# EAGLE schematic M220X (EAGLE 6.6.0)
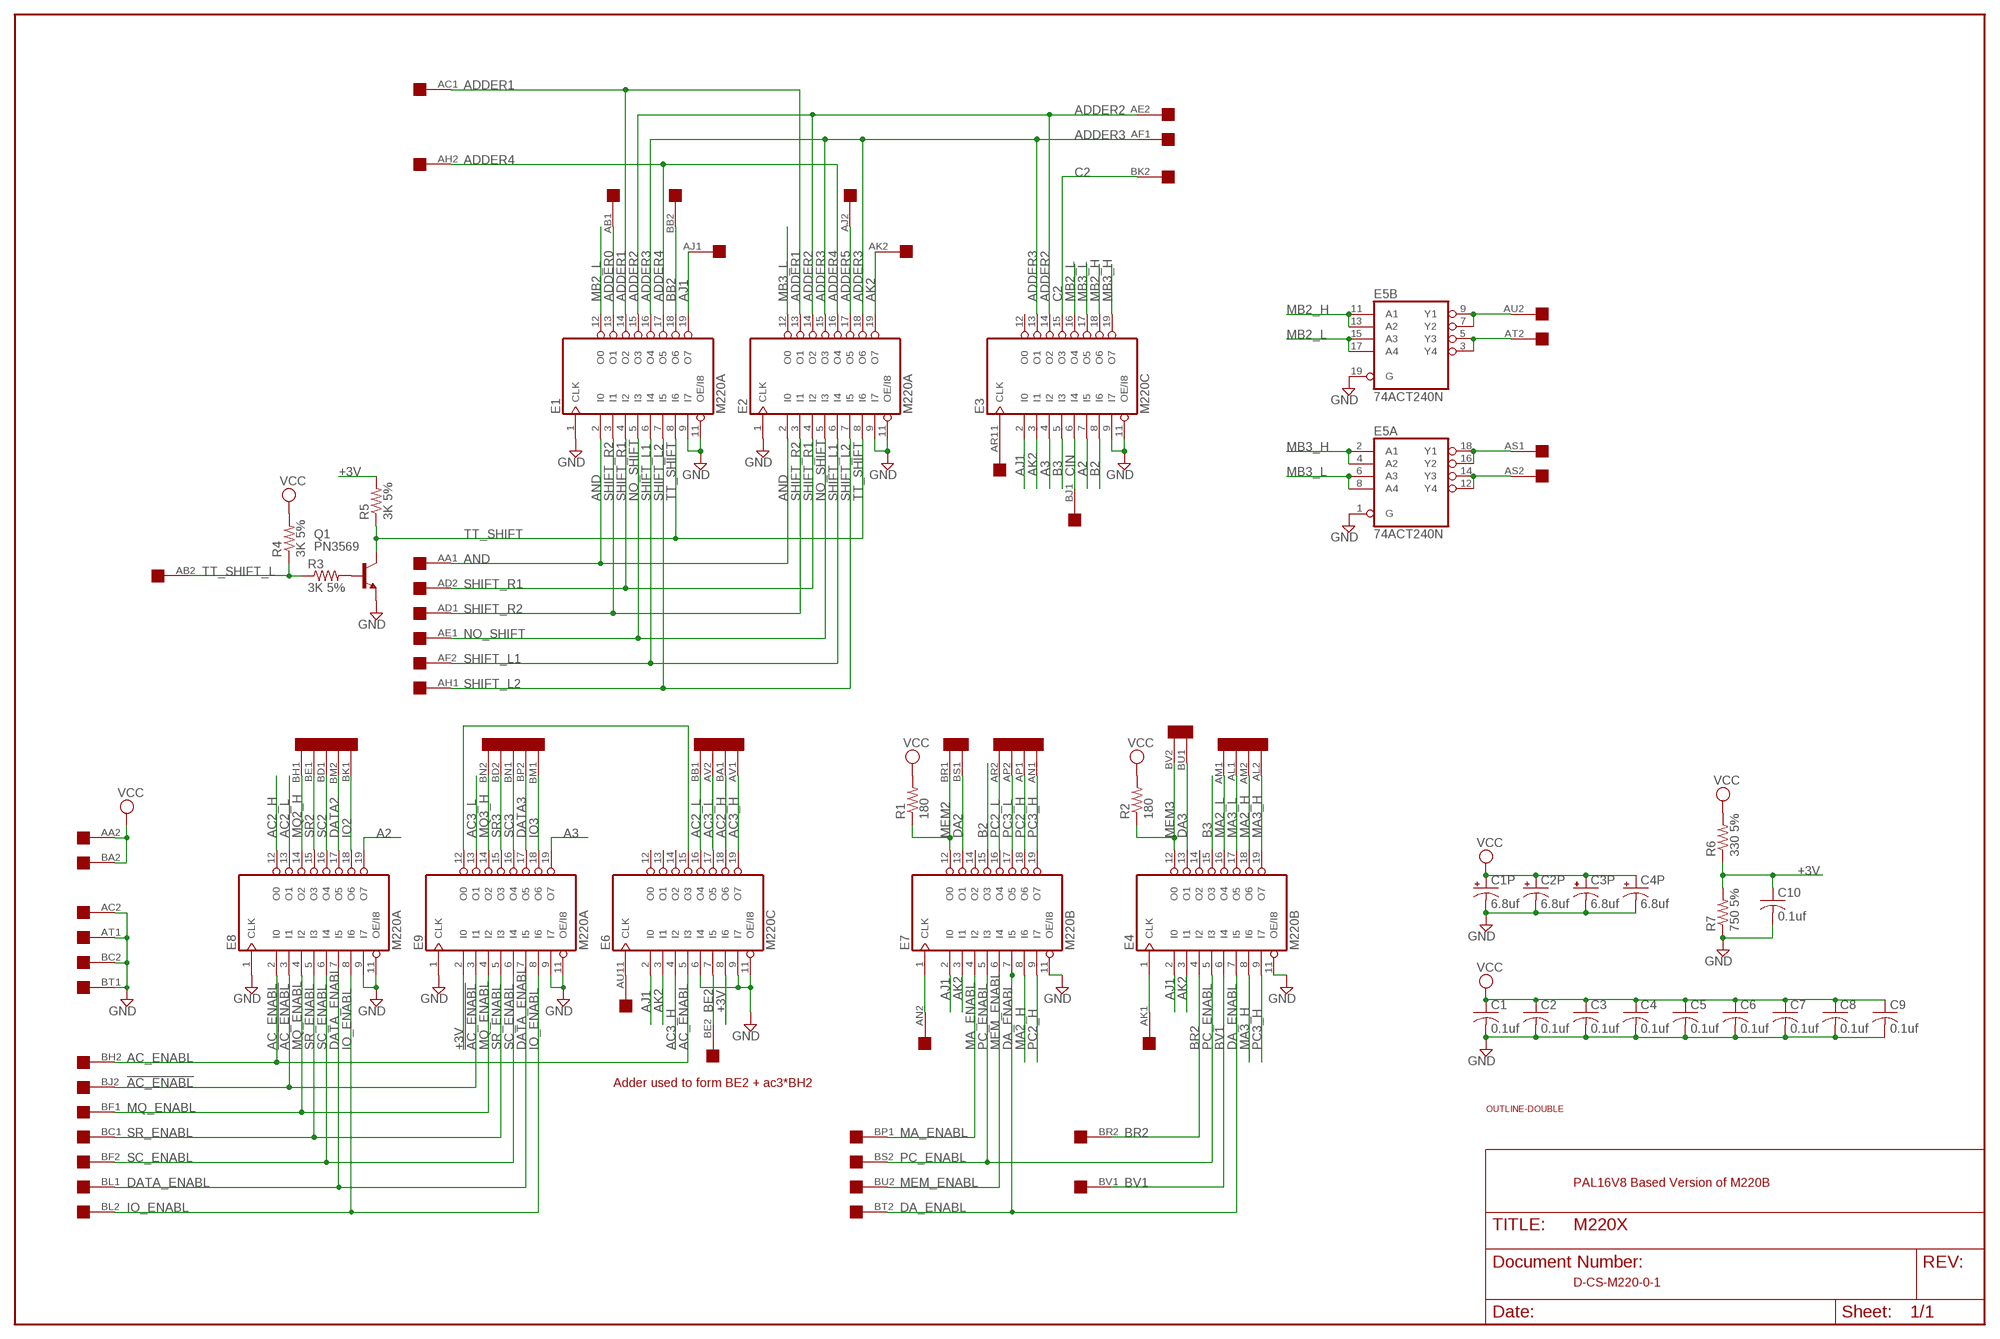
[diagram p0: schematic, sheet 1]

## Parts
C1  0.1uf  C-US050-025X075  [C050-025X075]
C1P  6.8uf  CPOL-USE15-5AXIAL  [E15-5]
C2  0.1uf  C-US050-025X075  [C050-025X075]
C2P  6.8uf  CPOL-USE15-5AXIAL  [E15-5]
C3  0.1uf  C-US050-025X075  [C050-025X075]
C3P  6.8uf  CPOL-USE15-5AXIAL  [E15-5]
C4  0.1uf  C-US050-025X075  [C050-025X075]
C4P  6.8uf  CPOL-USE15-5AXIAL  [E15-5]
C5  0.1uf  C-US050-025X075  [C050-025X075]
C6  0.1uf  C-US050-025X075  [C050-025X075]
C7  0.1uf  C-US050-025X075  [C050-025X075]
C8  0.1uf  C-US050-025X075  [C050-025X075]
C9  0.1uf  C-US050-025X075  [C050-025X075]
C10  0.1uf  C-US050-025X075  [C050-025X075]
E1  M220A  16V8  [DIL20]
E2  M220A  16V8  [DIL20]
E3  M220C  16V8  [DIL20]
E4  M220B  16V8  [DIL20]
E5  74ACT240N  74S240N  [DIL20]
E6  M220C  16V8  [DIL20]
E7  M220B  16V8  [DIL20]
E8  M220A  16V8  [DIL20]
E9  M220A  16V8  [DIL20]
Q1  PN3569  2N2102  [TO5]
R1  180  R-US_0207/10  [0207/10]
R2  180  R-US_0207/10  [0207/10]
R3  3K 5%  R-US_0207/10  [0207/10]
R4  3K 5%  R-US_0207/10  [0207/10]
R5  3K 5%  R-US_0207/10  [0207/10]
R6  330 5%  R-US_0207/10  [0207/10]
R7  750 5%  R-US_0207/10  [0207/10]
U$1  DOUBLE  [EDGE-CON4]
U$2  OUTLINE-DOUBLE  [DOUBLE]

## Nets
!AC_ENABL: E8.3(I1) E9.3(I1) U$1.BJ2
+3V [Supply]: C10.1 E6.8(I6) E9.2(I0) R5.2 R6.1 R7.2
A2: E3.7(I5) E8.19(O7)
A3 [Supply]: E3.4(I2) E9.19(O7)
AC2_H: E6.18(O6) E8.12(O0) U$1.BA1
AC2_L: E6.16(O4) E8.13(O1) U$1.BB1
AC3_H: E6.4(I2) E6.19(O7) U$1.AV1
AC3_L: E6.17(O5) E9.13(O1) U$1.AV2
AC_ENABL: E6.5(I3) E8.2(I0) U$1.BH2
ADDER0: E1.13(O1) U$1.AB1
ADDER1: E1.14(O2) E2.13(O1) U$1.AC1
ADDER2: E1.15(O3) E2.14(O2) E3.14(O2) U$1.AE2
ADDER3: E1.16(O4) E2.15(O3) E2.18(O6) E3.13(O1) U$1.AF1
ADDER4: E1.17(O5) E2.16(O4) U$1.AH2
ADDER5: E2.17(O5) U$1.AJ2
AJ1: E1.19(O7) E3.2(I0) E4.2(I0) E6.2(I0) E7.2(I0) U$1.AJ1
AK2: E2.19(O7) E3.3(I1) E4.3(I1) E6.3(I1) E7.3(I1) U$1.AK2
AND: E1.2(I0) E2.2(I0) U$1.AA1
B2: E3.8(I6) E7.15(O3)
B3: E3.5(I3) E4.15(O3)
BB2: E1.18(O6) U$1.BB2
BE2: E6.7(I5) U$1.BE2
BR2: E4.4(I2) U$1.BR2
BV1: E4.6(I4) U$1.BV1
C2: E3.15(O3) U$1.BK2
CIN: E3.6(I4) U$1.BJ1
DA2: E7.13(O1) U$1.BS1
DA3: E4.13(O1) U$1.BU1
DA_ENABL: E4.7(I5) E7.7(I5) U$1.BT2
DATA2: E8.17(O5) U$1.BM2
DATA3: E9.17(O5) U$1.BP2
DATA_ENABL: E8.7(I5) E9.7(I5) U$1.BL1
GND [Supply]: C1.2 C1P.- C2.2 C2P.- C3.2 C3P.- C4.2 C4P.- C5.2 C6.2 C7.2 C8.2 C9.2 C10.2 E1.1(CLK) E1.9(I7) E1.11(OE/I8) E2.1(CLK) E2.9(I7) E2.11(OE/I8) E3.9(I7) E3.11(OE/I8) E4.11(OE/I8) E5.1(A:G) E5.19(B:G) E6.6(I4) E6.9(I7) E6.11(OE/I8) E7.11(OE/I8) E8.1(CLK) E8.9(I7) E8.11(OE/I8) E9.1(CLK) E9.9(I7) E9.11(OE/I8) Q1.1(E) R7.1 U$1.AC2 U$1.AT1 U$1.BC2 U$1.BT1
IO2: E8.18(O6) U$1.BK1
IO3: E9.18(O6) U$1.BM1
IO_ENABL: E8.8(I6) E9.8(I6) U$1.BL2
MA2_H: E4.18(O6) E7.8(I6) U$1.AM2
MA2_L: E4.16(O4) U$1.AM1
MA3_H: E4.8(I6) E4.19(O7) U$1.AL2
MA3_L: E4.17(O5) U$1.AL1
MA_ENABL: E7.4(I2) U$1.BP1
MB2_H: E3.18(O6) E5.11(B:A1) E5.13(B:A2)
MB2_L: E1.12(O0) E3.16(O4) E5.15(B:A3) E5.17(B:A4)
MB3_H: E3.19(O7) E5.2(A:A1) E5.4(A:A2)
MB3_L: E2.12(O0) E3.17(O5) E5.6(A:A3) E5.8(A:A4)
MEM2: E7.12(O0) R1.1 U$1.BR1
MEM3: E4.12(O0) R2.1 U$1.BV2
MEM_ENABL: E7.6(I4) U$1.BU2
MQ2_H: E8.14(O2) U$1.BH1
MQ3_H: E9.14(O2) U$1.BN2
MQ_ENABL: E8.4(I2) E9.4(I2) U$1.BF1
N$1: E7.1(CLK) U$1.AN2
N$2: E4.1(CLK) U$1.AK1
N$3: E3.1(CLK) U$1.AR1
N$4: E6.1(CLK) U$1.AU1
N$5 [Supply]: E6.15(O3) E9.12(O0)
N$6: E5.12(A:Y4) E5.14(A:Y3) U$1.AS2
N$7: E5.16(A:Y2) E5.18(A:Y1) U$1.AS1
N$8: E5.3(B:Y4) E5.5(B:Y3) U$1.AT2
N$9: E5.7(B:Y2) E5.9(B:Y1) U$1.AU2
N$10: Q1.2(B) R3.2
NO_SHIFT: E1.5(I3) E2.5(I3) U$1.AE1
PC2_H: E7.9(I7) E7.18(O6) U$1.AP1
PC2_L: E7.16(O4) U$1.AR2
PC3_H: E4.9(I7) E7.19(O7) U$1.AN1
PC3_L: E7.17(O5) U$1.AP2
PC_ENABL: E4.5(I3) E7.5(I3) U$1.BS2
SC2: E8.16(O4) U$1.BD1
SC3: E9.16(O4) U$1.BN1
SC_ENABL: E8.6(I4) E9.6(I4) U$1.BF2
SHIFT_L1: E1.6(I4) E2.6(I4) U$1.AF2
SHIFT_L2: E1.7(I5) E2.7(I5) U$1.AH1
SHIFT_R1: E1.4(I2) E2.4(I2) U$1.AD2
SHIFT_R2: E1.3(I1) E2.3(I1) U$1.AD1
SR2: E8.15(O3) U$1.BE1
SR3: E9.15(O3) U$1.BD2
SR_ENABL: E8.5(I3) E9.5(I3) U$1.BC1
TT_SHIFT: E1.8(I6) E2.8(I6) Q1.3(C) R5.1
TT_SHIFT_L: R3.1 R4.1 U$1.AB2
VCC [Supply]: C1.1 C1P.+ C2.1 C2P.+ C3.1 C3P.+ C4.1 C4P.+ C5.1 C6.1 C7.1 C8.1 C9.1 R1.2 R2.2 R4.2 R6.2 U$1.AA2 U$1.BA2
Unconnected: E3.12(O0) E4.14(O2) E6.12(O0) E6.13(O1) E6.14(O2) E7.14(O2)

## Notes on the sheet
- Adder used to form BE2 + ac3*BH2
- PAL16V8 Based Version of M220B
- D-CS-M220-0-1

## Power pins joined to a net without a drawn wire
GND: E1.10(GND) E2.10(GND) E3.10(GND) E4.10(GND) E5.10(P:GND) E6.10(GND) E7.10(GND) E8.10(GND) E9.10(GND)
VCC: E1.20(VCC) E2.20(VCC) E3.20(VCC) E4.20(VCC) E5.20(P:VCC) E6.20(VCC) E7.20(VCC) E8.20(VCC) E9.20(VCC)

## Library data of the parts
C1-C10 = rcl:C-US: CAPACITOR, American symbol
C1P C2P C3P C4P = rcl:CPOL-US: POLARIZED CAPACITOR, American symbol
E1-E4 E6-E9 = pal:16V8: PAL; MPN: GAL16V8D-7LPN; OC_FARNELL: 9699740; OC_NEWARK: 97K0449
E5 = 74xx-us:74*240: Octal BUFFER and LINE DRIVER, 3-state
Q1 = transistor:2N2102: NPN TRANSISTOR
R1-R7 = rcl:R-US_: RESISTOR, American symbol
U$1 = dec-con:DOUBLE: Double-Height DEC board
U$2 = dec-con:OUTLINE-*: Board outlines for DEC boards.

## Net classes
1 Supply: width 0.813 mm